# Altium schematic sheet Memory.SchDoc
size A
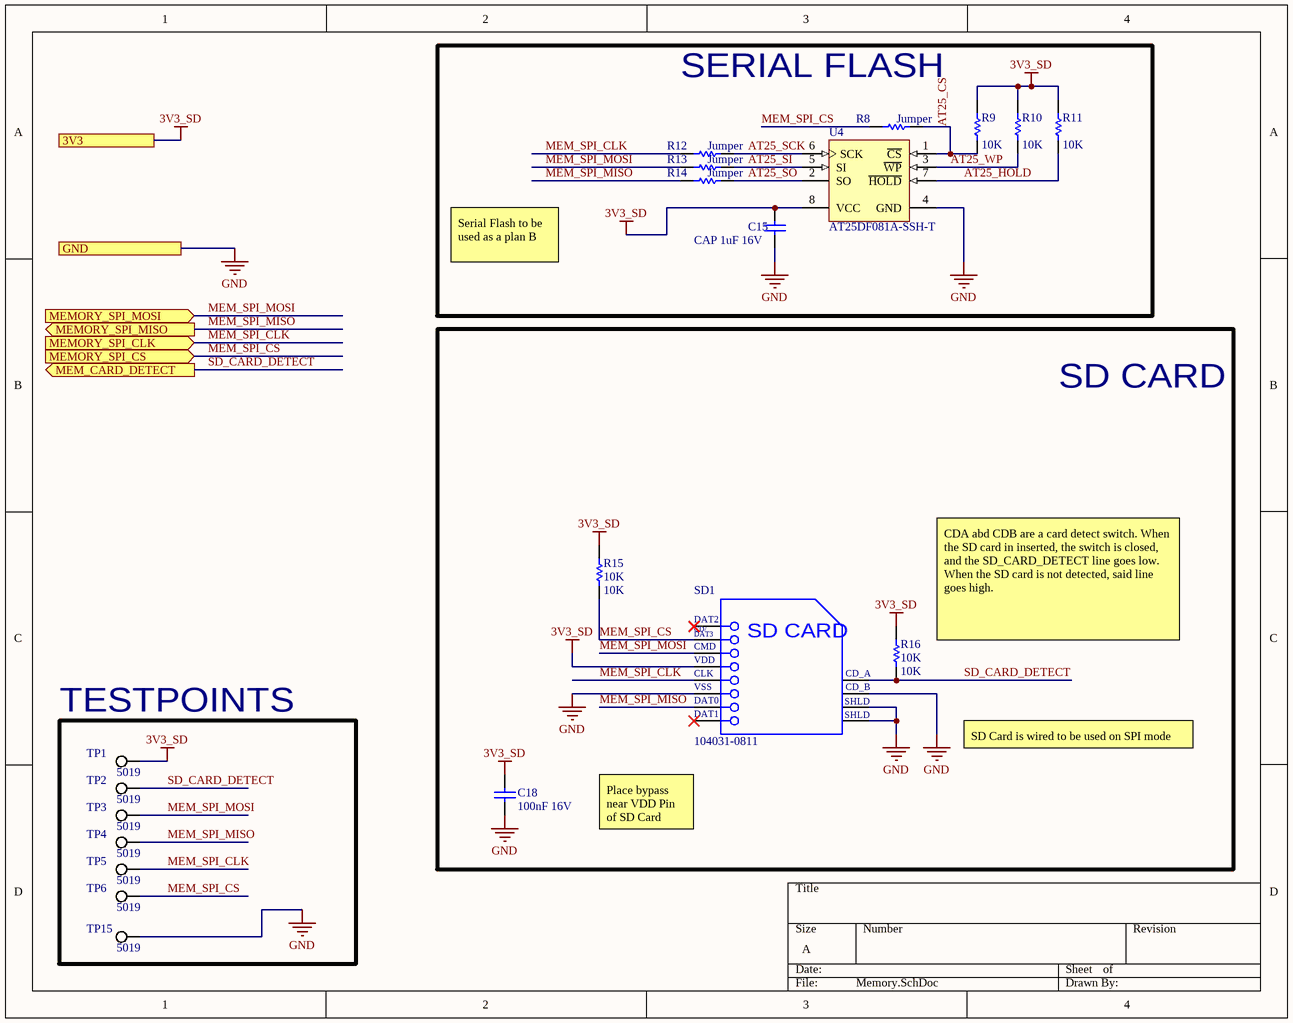
[diagram p0: Memory.SchDoc]

## Parts
C15  CAP 1uF 16V  [CAPC0603(1608)100_N]
C18  100nF 16V  [CAPC0603(1608)100_N]
R8  Jumper  [RESC0603(1608)_N]
R9  value 10K  [J1-0603]
R10  value 10K  [J1-0603]
R11  value 10K  [J1-0603]
R12  Jumper  [RESC0603(1608)_N]
R13  Jumper  [RESC0603(1608)_N]
R14  Jumper  [RESC0603(1608)_N]
R15  10K  [J1-0603]
R16  10K  [J1-0603]
SD1  104031-0811  [MOLX-104031-0811_V]
TP1  5019  [KSTN-5019_V]  (no BOM)
TP2  5019  [KSTN-5019_V]  (no BOM)
TP3  5019  [KSTN-5019_V]  (no BOM)
TP4  5019  [KSTN-5019_V]  (no BOM)
TP5  5019  [KSTN-5019_V]  (no BOM)
TP6  5019  [KSTN-5019_V]  (no BOM)
TP15  5019  [KSTN-5019_V]  (no BOM)
U4  AT25DF081A-SSH-T  [AT25DF081A-SSH-T]

## Blocks framed on the sheet
SERIAL FLASH: C15 R8-R14 U4
SD CARD: C18 R15 R16 SD1
TESTPOINTS: TP1-TP6 TP15

## Ports
3V3, GND, MEM_CARD_DETECT (out), MEMORY_SPI_CLK (in), MEMORY_SPI_CS (in), MEMORY_SPI_MISO (out), MEMORY_SPI_MOSI (in)

## Nets
3V3_SD: C15.2 C18.2 R9.2 R10.2 R11.2 R15.2 R16.2 SD1.4(VDD) TP1.1 U4.8(VCC) ; port 3V3
GND: C15.1 C18.1 SD1.6(VSS2) SD1.10(CD_B) SD1.11(SHLD1) SD1.12(SHLD2) TP15.1 U4.4(GND) ; port GND
AT25_CS: R8.2 R9.1 U4.1(~{CS})
AT25_HOLD: R11.1 U4.7(~{HOLD})
AT25_SCK: R12.2 U4.6(SCK)
AT25_SI: R13.2 U4.5(SI)
AT25_SO: R14.2 U4.2(SO)
AT25_WP: R10.1 U4.3(~{WP})
MEM_SPI_CLK: R12.1 SD1.5(CLK) TP5.1 ; port MEMORY_SPI_CLK
MEM_SPI_CS: R8.1 R15.1 SD1.2(CMD) TP6.1 ; port MEMORY_SPI_CS
MEM_SPI_MISO: R14.1 SD1.7(DAT0) TP4.1 ; port MEMORY_SPI_MISO
MEM_SPI_MOSI: R13.1 SD1.3(VSS1) TP3.1 ; port MEMORY_SPI_MOSI
SD_CARD_DETECT: R16.1 SD1.9(CD_A) TP2.1 ; port MEM_CARD_DETECT

Not connected (* = marked no-connect by the designer): SD1 1(CD/DAT3)* 8(DAT1)*

## Notes on the sheet
- Serial Flash to be used as a plan B
- (near R16) CDA abd CDB are a card detect switch. When the SD card in inserted, the switch is closed, and the SD_CARD_DETECT line goes low. When the SD card is not detected, said line goes high.
- SD Card is wired to be used on SPI mode
- Place bypass near VDD Pin of SD Card
- (in symbol CMP-2000-05825-1) DAT2; CD/; DAT3; SD CARD; VSS; SHLD

## Library data of the parts
C15 = CMP-1035-02737-1: CAP 1uF 16V ±10% 0603 (1608 Metric) Thickness 1mm SMD; Case-Metric: 1608; Tolerance: Â±10%; Case-EIA: 0603; Rated Voltage: 16 V; Max Thickness: 1 mm; Technology: SMT; Value: 1uF
C18 = CMP-1035-02584-1: CAP 100nF 16V ±10% 0603 (1608 Metric) Thickness 1mm SMD; Tolerance: Â±10%; Case-EIA: 0603; Case-Metric: 1608; Technology: SMT; Max Thickness: 1 mm; Value: 100nF; Rated Voltage: 16 V
R8 R12-R14 = CMP-1012-00001-1: Jumper 0603 (1608 Metric); Case-Metric: 1608; Value: 0.00 Ohm; Power: None; Case-EIA: 0603; Technology: SMT; Tolerance: None
R9-R11 R15 R16 = Res1: Resistor; Published: 8-Jun-2000; LatestRevisionDate: 17-Jul-2002; LatestRevisionNote: Re-released for DXP Platform.; PackageReference: AXIAL-0.3; Publisher: Altium Limited; PackageDescription: Axial Device, Thru-Hole; 2 Leads; 0.3 in Pin Spacing
  R15 R16: Value: 10K
SD1 = CMP-2000-05825-1: Micro SD Card, RA, -25 to 85 degC, 8-Pin SMD, RoHS, Tape and Reel; Voltage Rating: 10VAC/DC; Number of Contacts: 8; Insertion - Extraction Style: Push-Pull; Pitch: 1.1mm; Mating Cycles: 10000; Brand: Molex; Current Rating: 500mA; Manufacturer URL: http://www.molex.com/; Card Type: microSD; Mounting Type: Standard; Height: 1.42mm; Mounting Technology: SurfaceMount; Contact Plating: Gold; Product Category: MemoryCardConnectors; Package Description: 8-Pin Surface Mount Device, Body 11.95 x 11.4 mm, Pitch 1.1 mm; Datasheet URL: http://www.molex.com/pdm_docs/sd/1040310811_sd.pdf; Termination Style: SMD; Length: 11.4mm; Housing Material: LiquidCrystalPolymer(LCP); Orientation: RightAngle; RoHS: True; Contact Material: PhosphorBronze; Datasheet Version: Rev. E, 04/2006; Packaging: Reel; Manufacturer: Molex; Series: 104031; Product: CardConnectors; Number of Rows: 1Row; Package Reference: 104031-0811
TP1-TP6 TP15 = CMP-1672-00008-1: Test Point, 1 Position SMD, RoHS, Tape and Reel; ComponentLink1Description: Manufacturer URL; Package Quantity: 1000; DatasheetVersion: 03/2014; Packaging: Tape and Reel; ComponentLink2URL: http://www.keyelco.com/product-pdf.cfm?p=1357; ComponentLink1URL: http://www.keyelco.com/; Mount: Surface Mount; Contact Plating: Silver; PackageDescription: 1-Pin Surface Mount Device, Body 3.81 x 2.03 mm; Pins: 1; RoHSCompliant: True; Mounting Technology: Surface Mount; ComponentLink2Description: Datasheet; PackageReference: 5019
U4 = AT25DF081A-SSH-T: IC FLASH 8MBIT 100MHZ 8SOIC; Manufacturer: Adesto Technologies; Memory Size: 8M (4096 pages x 256 bytes); Interface: SPI, RapidS; Voltage - Supply: 2.7 V ~ 3.6 V; Rad Hard: No; Manufacturer Part Number: AT25DF081A-SSH-T; RoHS: RoHS Compliant; Category: Integrated Circuits (ICs); Packaging: Cut Tape (CT); Part Status: Active; Format - Memory: FLASH; Memory Type: FLASH; Speed: 100MHz; Operating Temperature: -40°C ~ 85°C (TC); Package / Case: 8-SOIC (0.154", 3.90mm Width); Supplier Device Package: 8-SOIC; ComponentLink1URL: http://www.adestotech.com/wp-content/uploads/doc8715.pdf; ComponentLink1Description: http://www.adestotech.com/wp-content/uploads/doc8715.pdf; Supplier 1: Digikey; Stock 1: 2550; Pricing 1: 1=1.18, 10=1.081, 25=1.0516, 50=1.0462, 100=0.9352, 250=0.9324, 500=0.9185, 1000=0.8791 (USD); Package: 8SOIC; ComponentLink2URL: https://datasheet.ciiva.com/14084/doc8715-14084443.pdf; ComponentLink2Description: https://datasheet.ciiva.com/14084/doc8715-14084443.pdf; ComponentLink3URL: https://datasheet.ciiva.com/26910/getdatasheetpartid-730210-26910875.pdf; ComponentLink3Description: https://datasheet.ciiva.com/26910/getdatasheetpartid-730210-26910875.pdf; ComponentLink4URL: https://datasheet.ciiva.com/12251/doc8715-12251468.pdf; ComponentLink4Description: https://datasheet.ciiva.com/12251/doc8715-12251468.pdf; Supplier Part Number 1: 1265-1166-1-ND